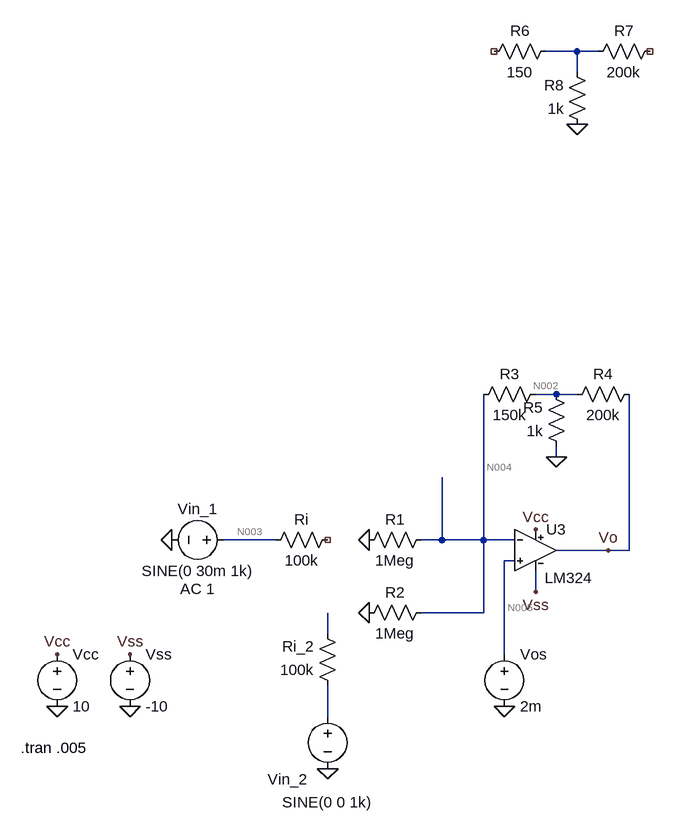
[diagram p0: schematic tp2 _b.asc]
tp2 _b.asc, the LTspice schematic file:
Version 4
SHEET 1 880 680
WIRE 160 -624 112 -624
WIRE 192 -624 160 -624
WIRE 160 -592 160 -624
WIRE 128 -96 96 -96
WIRE 160 -96 128 -96
WIRE 128 0 128 -16
WIRE -304 128 -384 128
WIRE -48 128 -48 32
WIRE -48 128 -80 128
WIRE 16 128 16 -96
WIRE 16 128 -48 128
WIRE 64 128 16 128
WIRE 208 144 128 144
WIRE 240 144 240 -96
WIRE 240 144 208 144
WIRE 64 160 48 160
WIRE 96 208 96 176
WIRE 16 240 16 128
WIRE 16 240 -80 240
WIRE -224 272 -224 240
WIRE 48 304 48 160
WIRE -224 400 -224 352
FLAG 96 208 Vss
FLAG -528 304 Vss
FLAG -640 304 Vcc
FLAG 96 112 Vcc
FLAG -640 384 0
FLAG -528 384 0
FLAG -464 128 0
FLAG -224 480 0
FLAG 208 144 Vo
FLAG -160 240 0
FLAG -160 128 0
FLAG 48 384 0
FLAG 160 -512 0
FLAG 128 0 0
SYMBOL voltage -368 128 R90
WINDOW 0 -32 56 VBottom 2
WINDOW 3 32 56 VTop 2
WINDOW 123 60 56 VTop 2
WINDOW 39 0 0 Left 0
SYMATTR InstName Vin_1
SYMATTR Value SINE(0 30m 1k)
SYMATTR Value2 AC 1
SYMBOL voltage -640 288 R0
WINDOW 123 0 0 Left 0
WINDOW 39 0 0 Left 0
SYMATTR InstName Vcc
SYMATTR Value 10
SYMBOL voltage -528 288 R0
WINDOW 123 0 0 Left 0
WINDOW 39 0 0 Left 0
SYMATTR InstName Vss
SYMATTR Value -10
SYMBOL voltage -224 384 R0
WINDOW 0 -61 128 Bottom 2
WINDOW 3 -1 132 Top 2
WINDOW 123 -60 -67 VTop 2
WINDOW 39 0 0 Left 0
SYMATTR InstName Vin_2
SYMATTR Value SINE(0 0 1k)
SYMBOL AutoGenerated\\LM324 96 144 R0
WINDOW 3 51 27 Top 2
SYMATTR InstName U3
SYMBOL res -64 112 R90
WINDOW 0 0 56 VBottom 2
WINDOW 3 32 56 VTop 2
SYMATTR InstName R1
SYMATTR Value 1Meg
SYMBOL res -64 224 R90
WINDOW 0 0 56 VBottom 2
WINDOW 3 32 56 VTop 2
SYMATTR InstName R2
SYMATTR Value 1Meg
SYMBOL res -208 368 R180
WINDOW 0 36 76 Left 2
WINDOW 3 36 40 Left 2
SYMATTR InstName Ri_2
SYMATTR Value 100k
SYMBOL res -320 144 R270
WINDOW 0 32 56 VTop 2
WINDOW 3 0 56 VBottom 2
SYMATTR InstName Ri
SYMATTR Value 100k
SYMBOL res 112 -112 R90
WINDOW 0 0 56 VBottom 2
WINDOW 3 32 56 VTop 2
SYMATTR InstName R3
SYMATTR Value 150k
SYMBOL voltage 48 288 R0
WINDOW 123 0 0 Left 0
WINDOW 39 0 0 Left 0
SYMATTR InstName Vos
SYMATTR Value 2m
SYMBOL res 256 -112 R90
WINDOW 0 0 56 VBottom 2
WINDOW 3 32 56 VTop 2
SYMATTR InstName R4
SYMATTR Value 200k
SYMBOL res 144 0 R180
WINDOW 0 36 76 Left 2
WINDOW 3 36 40 Left 2
SYMATTR InstName R5
SYMATTR Value 1k
SYMBOL res 128 -640 R90
WINDOW 0 0 56 VBottom 2
WINDOW 3 32 56 VTop 2
SYMATTR InstName R6
SYMATTR Value 150
SYMBOL res 288 -640 R90
WINDOW 0 0 56 VBottom 2
WINDOW 3 32 56 VTop 2
SYMATTR InstName R7
SYMATTR Value 200k
SYMBOL res 176 -496 R180
WINDOW 0 36 76 Left 2
WINDOW 3 36 40 Left 2
SYMATTR InstName R8
SYMATTR Value 1k
TEXT -696 448 Left 2 !.tran .005

The netlist it stands for:
* tp2 _b.asc
Vin_1 N003 0 SINE(0 30m 1k) AC 1
Vcc Vcc 0 10
Vss Vss 0 -10
Vin_2 N007 0 SINE(0 0 1k)
XU3 N005 N004 Vcc Vss Vo LM324  ; pins In+ In- V+ V- OUT
R1 N004 0 1Meg
R2 N004 0 1Meg
Ri_2 N007 N006 100k
Ri N003 NC_01 100k
R3 N002 N004 150k
Vos N005 0 2m
R4 Vo N002 200k
R5 0 N002 1k
R6 N001 NC_02 150
R7 NC_03 N001 200k
R8 0 N001 1k
.tran .005
.lib E:\LtSpice_components\LM324.ti.lib
.backanno
.end

* Results of the author's LTspice run, read from the files saved beside the schematic
* Operating Point, zero values left out:
*   V(vcc) = 10 V
*   V(vss) = -10 V
*   V(vo) = -90.35 mV
*   V(n004) = 1.967 mV
*   V(n005) = 2 mV
*   V(n002) = -433.6 µV
*   I(R1) = 1.967 nA
*   I(R2) = 1.967 nA
*   I(R3) = -16 nA
*   I(R4) = -449.6 nA
*   I(R5) = 433.6 nA
*   I(Vcc) = -669.9 µA
*   I(Vss) = 669.8 µA
*   I(Vos) = 19.92 nA
*   Ix(u3:1) = -19.92 nA
*   Ix(u3:2) = -19.94 nA
*   Ix(u3:3) = 669.9 µA
*   Ix(u3:4) = -669.8 µA
*   Ix(u3:5) = 449.6 nA
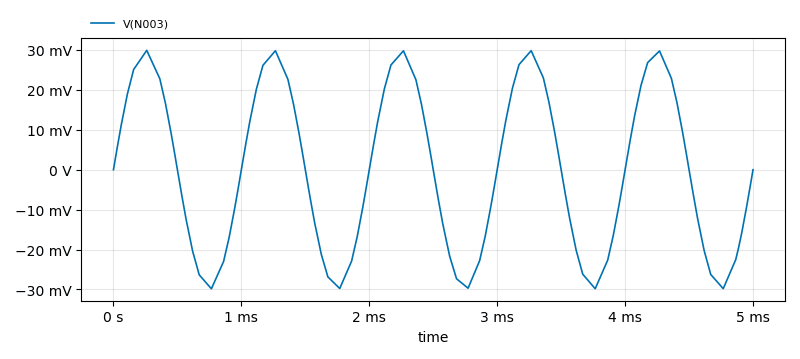
[diagram p1: Transient Analysis of tp2 _b.asc, plotted from the saved traces]
* Transient Analysis, 1 run:
*   V(N003): min -29.83 mV, max 29.91 mV, average -12.08 µV, rms 20.87 mV, last 0 V